# Altium schematic sheet 01.SchDoc
size 513 x 386 mm
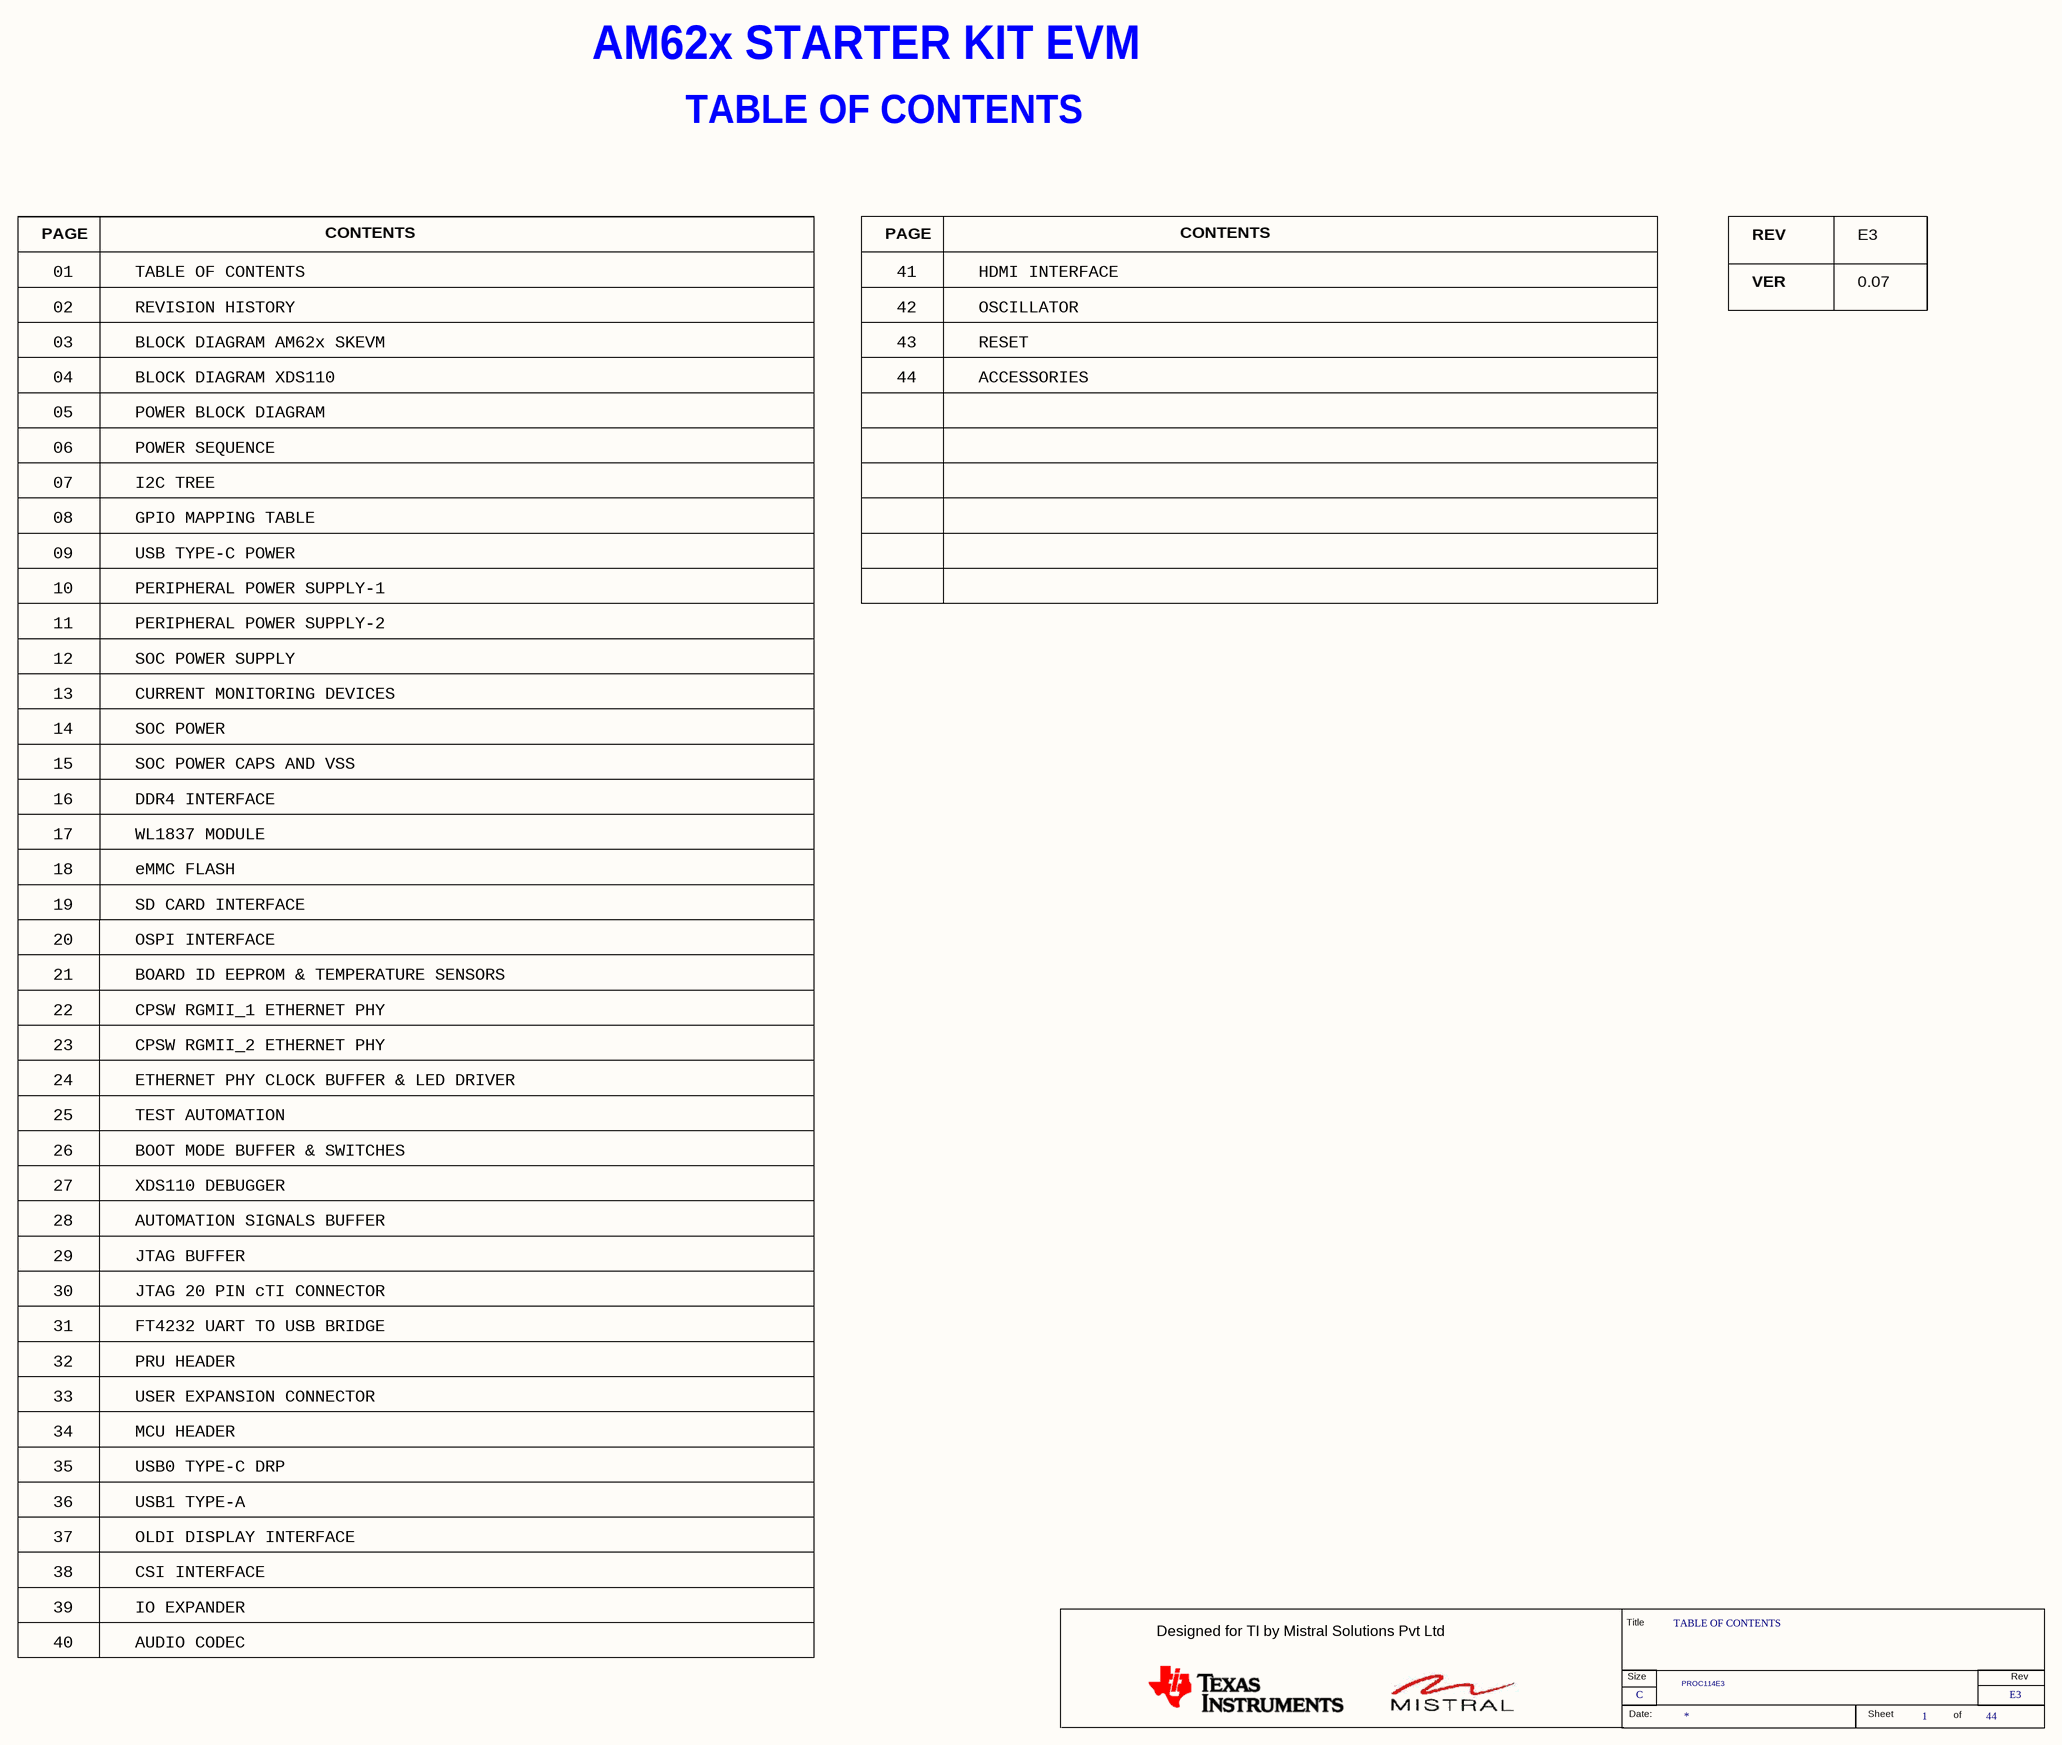
[diagram p0: 01.SchDoc]

## Parts
*  RevCode: E3  Title: TABLE OF CONTENTS  Page Size: C  Page Number: 1  Page Count: 44  Variant Name: PROC114E3  (hidden comment: MISTRAL_TITLEBLK_CSIZE)  (graphical)

## Notes on the sheet
- AM62x STARTER KIT EVM
- TABLE OF CONTENTS
- PAGE
- CONTENTS
- REV
- E3
- 01
- 41
- HDMI INTERFACE
- VER
- 0.07
- 02
- 03
- REVISION HISTORY
- BLOCK DIAGRAM AM62x SKEVM
- 42
- 43
- OSCILLATOR
- RESET
- 04
- BLOCK DIAGRAM XDS110
- 44
- ACCESSORIES
- 06
- 05
- POWER BLOCK DIAGRAM
- POWER SEQUENCE
- 07
- 08
- GPIO MAPPING TABLE
- I2C TREE
- 09
- USB TYPE-C POWER
- 11
- 10
- PERIPHERAL POWER SUPPLY-1
- PERIPHERAL POWER SUPPLY-2
- 12
- 13
- SOC POWER SUPPLY
- CURRENT MONITORING DEVICES
- 14
- SOC POWER
- 15
- 16
- SOC POWER CAPS AND VSS
- DDR4 INTERFACE
- 17
- 18
- eMMC FLASH
- WL1837 MODULE
- 19
- SD CARD INTERFACE
- 20
- 21
- OSPI INTERFACE
- BOARD ID EEPROM & TEMPERATURE SENSORS
- 22
- 23
- CPSW RGMII_1 ETHERNET PHY
- CPSW RGMII_2 ETHERNET PHY
- 24
- ETHERNET PHY CLOCK BUFFER & LED DRIVER
- 25
- 26
- BOOT MODE BUFFER & SWITCHES
- TEST AUTOMATION
- 27
- 28
- XDS110 DEBUGGER
- AUTOMATION SIGNALS BUFFER
- 29
- JTAG BUFFER
- 30
- 31
- JTAG 20 PIN cTI CONNECTOR
- FT4232 UART TO USB BRIDGE
- 32
- 33
- PRU HEADER
- USER EXPANSION CONNECTOR
- 34
- MCU HEADER
- 35
- 36
- USB0 TYPE-C DRP
- USB1 TYPE-A
- 37
- 38
- OLDI DISPLAY INTERFACE
- CSI INTERFACE
- 39
- IO EXPANDER
- 40
- AUDIO CODEC
- (in symbol MISTRAL_TITLEBLK_CSIZE) Title; Designed for TI by Mistral Solutions Pvt Ltd; Size; Rev; Date:; Sheet; of

## Library data of the parts
* = MISTRAL_TITLEBLK_CSIZE: Issue: 1.0; Page Create Date: March  8, 1995; Page Modify Date: *; Schematic Page Count: 44; Schematic Page Number: 1